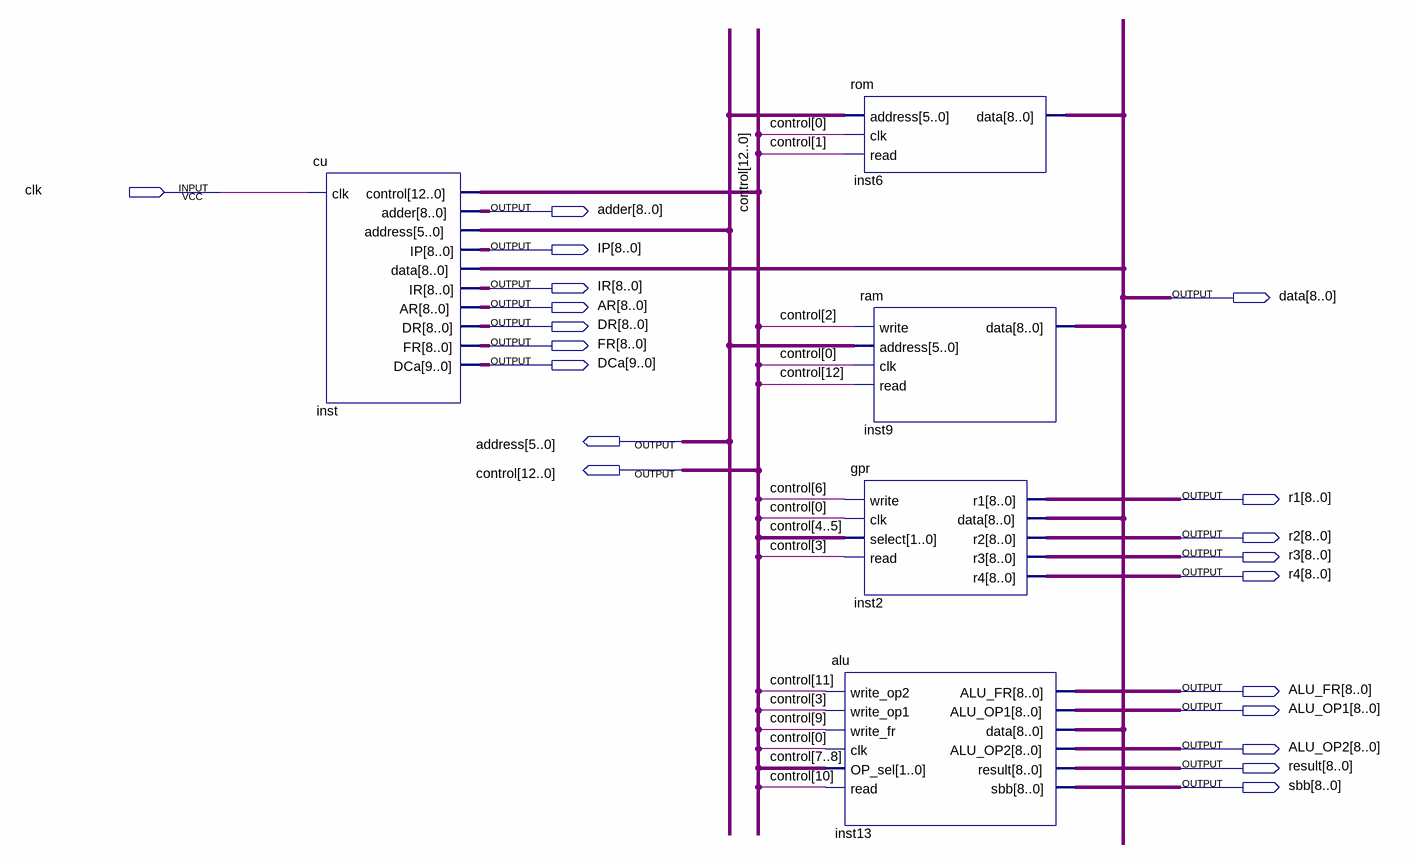
[diagram p0: schematic sheet]
// Quartus schematic lab4.bdf as structural Verilog: 5 symbols, 20 pins
module lab4 (
  input  clk,
  output [8:0] adder,
  output [8:0] IP,
  output [8:0] IR,
  output [8:0] data,
  output [8:0] AR,
  output [8:0] DR,
  output [8:0] FR,
  output [9:0] DCa,
  output [5:0] address,
  output [12:0] control,
  output [8:0] r1,
  output [8:0] r2,
  output [8:0] r3,
  output [8:0] r4,
  output [8:0] ALU_FR,
  output [8:0] ALU_OP1,
  output [8:0] ALU_OP2,
  output [8:0] result,
  output [8:0] sbb
);

  cu inst (
    .clk(clk), .control(control), .adder(adder), .address(address), .IP(IP), .data(data), .IR(IR), .AR(AR),
    .DR(DR), .FR(FR), .DCa(DCa));
  rom inst6 (.address(address), .clk(control[0]), .read(control[1]), .data(data));
  ram inst9 (.write(control[2]), .address(address), .clk(control[0]), .read(control[12]), .data(data));
  gpr inst2 (
    .write(control[6]), .clk(control[0]), .select({control[4], control[5]}), .read(control[3]), .r1(r1),
    .data(data), .r2(r2), .r3(r3), .r4(r4));
  alu inst13 (
    .write_op2(control[11]), .write_op1(control[3]), .write_fr(control[9]), .clk(control[0]),
    .OP_sel({control[7], control[8]}), .read(control[10]), .ALU_FR(ALU_FR), .ALU_OP1(ALU_OP1), .data(data),
    .ALU_OP2(ALU_OP2), .result(result), .sbb(sbb));
endmodule
